# Altium schematic sheet DIV2_8B.SCHDOC
size A4; Organization: Altium Limited; Address1: L3, 12a Rodborough Rd; Address2: Frenchs Forest; Address3: NSW; Address4: Australia 2086; DocumentNumber: 15; SheetNumber: 15; SheetTotal: 22
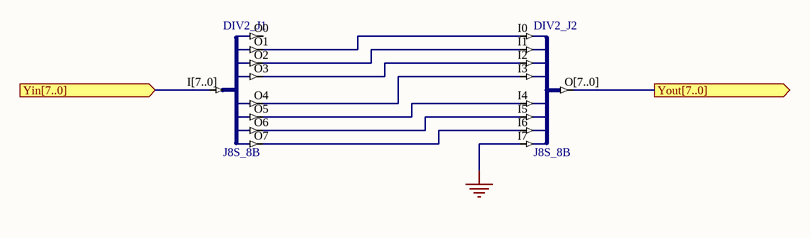
[diagram p0: DIV2_8B.SCHDOC]

## Parts
DIV2_J1  J8S_8B
DIV2_J2  J8S_8B

## Ports
Yin[7..0] (in), Yout[7..0] (out)

## Nets
GND: DIV2_J2.I7
Yin[7..0]: DIV2_J1.I[7..0] ; port Yin[7..0]
Yout[7..0]: DIV2_J2.O[7..0] ; port Yout[7..0]
NetDIV2_J1_O1: DIV2_J1.O1 DIV2_J2.I0
NetDIV2_J1_O2: DIV2_J1.O2 DIV2_J2.I1
NetDIV2_J1_O3: DIV2_J1.O3 DIV2_J2.I2
NetDIV2_J1_O4: DIV2_J1.O4 DIV2_J2.I3
NetDIV2_J1_O5: DIV2_J1.O5 DIV2_J2.I4
NetDIV2_J1_O6: DIV2_J1.O6 DIV2_J2.I5
NetDIV2_J1_O7: DIV2_J1.O7 DIV2_J2.I6

Not connected (* = marked no-connect by the designer): DIV2_J1 O0

## Notes on the sheet
- Title
- Size:
- Date:
- A4
- Number:
- Time:
- Revision:
- Sheet
- of
- File:

## Library data of the parts
DIV2_J1 = J8B_8S: 8-Bit input bus to 8 single pin outputs; ArchiveName: GENERIC; Published: 9-30-2003; Publisher: Altium Limited; Core Revision: 1.00.00
DIV2_J2 = J8S_8B: 8 Single pin inputs to single 8-Bit output bus; ArchiveName: GENERIC; Published: 9-30-2003; Publisher: Altium Limited; Core Revision: 1.00.00